# Altium schematic sheet User - Input.SchDoc
size A; SheetNumber: 8; SheetTotal: 11
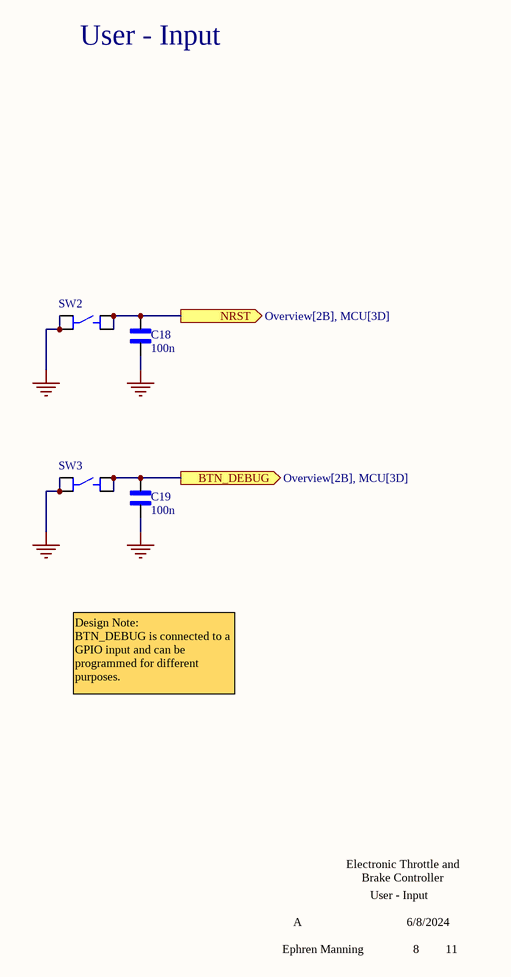
[diagram p0: User - Input.SchDoc]

## Parts
C18  100n  [CAP_0402-Footprint-1]
C19  100n  [CAP_0402-Footprint-1]
SW2  PTS810_SJM_250_SMTR_LFS  [SW_PTS810_SJM_250_SMTR_LFS]  (value not drawn)
SW3  PTS810_SJM_250_SMTR_LFS  [SW_PTS810_SJM_250_SMTR_LFS]  (value not drawn)

## Ports
BTN_DEBUG (out, see Overview[2B], MCU[3D]), NRST (out, see Overview[2B], MCU[3D])

## Nets
GND: C18.1 C19.1 SW2.1 SW2.2 SW3.1 SW3.2
BTN_DEBUG: C19.2 SW3.3 SW3.4 ; port BTN_DEBUG
NRST: C18.2 SW2.3 SW2.4 ; port NRST

## Notes on the sheet
- User - Input
- Design Note:
  BTN_DEBUG is connected to a GPIO input and can be programmed for different purposes.
- Electronic Throttle and
  Brake Controller
- A
- 6/8/2024
- Ephren Manning
- 8
- 11
- Project Title:
- Sheet Title:
- Revision:
- Date:
- Author:
- Sheet        of

## Library data of the parts
C18 C19 = CMP-00066-3: 100nF 10V 10% 0402 CAP; Manufacturer Part Number 1: CL05B104KP5NNNC; Manufacturer 1: Samsung Electro-Mechanics; Digikey Part Number: 1276-1002-1-ND
SW2 SW3 = CMP-014-000000-4: Tactile Switch SPST-NO Top Actuated Surface Mount; Manufacturer Part Number 1: PTS810 SJM 250 SMTR LFS; Manufacturer 1: C&K; Digikey Part Number: CKN10502CT-ND